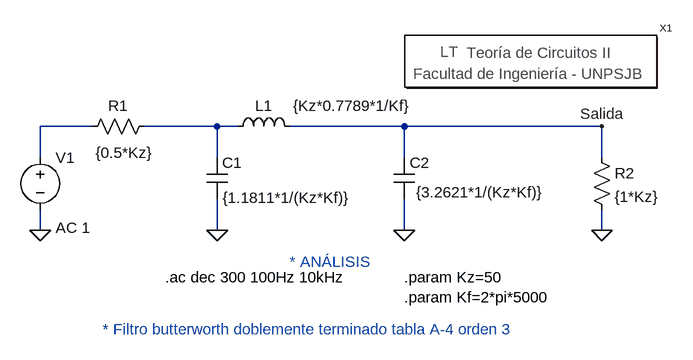
[diagram p0: schematic FiltroButterworthOrden3.asc]
FiltroButterworthOrden3.asc, the LTspice schematic file:
Version 4
SHEET 1 988 680
WIRE 96 160 16 160
WIRE 288 160 176 160
WIRE 320 160 288 160
WIRE 576 160 400 160
WIRE 880 160 576 160
WIRE 16 208 16 160
WIRE 288 208 288 160
WIRE 576 208 576 160
WIRE 880 208 880 160
WIRE 16 320 16 288
WIRE 288 320 288 272
WIRE 576 320 576 272
WIRE 880 320 880 288
FLAG 16 320 0
FLAG 880 320 0
FLAG 576 320 0
FLAG 288 320 0
FLAG 880 160 Salida
SYMBOL Circuitos2\\Letreros\\Teoría\ de\ Circuitos\ II 768 64 R0
SYMATTR InstName X1
SYMBOL voltage 16 192 R0
WINDOW 123 24 124 Left 2
WINDOW 39 0 0 Left 0
SYMATTR Value2 AC 1
SYMATTR InstName V1
SYMATTR Value ""
SYMBOL res 192 144 R90
WINDOW 0 0 56 VBottom 2
WINDOW 3 41 47 VTop 2
SYMATTR InstName R1
SYMATTR Value {0.5*Kz}
SYMBOL cap 272 208 R0
WINDOW 3 25 62 Left 2
SYMATTR InstName C1
SYMATTR Value {1.1811*1/(Kz*Kf)}
SYMBOL ind 304 176 R270
WINDOW 0 32 56 VTop 2
WINDOW 3 63 191 VBottom 2
SYMATTR InstName L1
SYMATTR Value {Kz*0.7789*1/Kf}
SYMBOL cap 560 208 R0
WINDOW 3 34 53 Left 2
SYMATTR InstName C2
SYMATTR Value {3.2621*1/(Kz*Kf)}
SYMBOL res 864 192 R0
SYMATTR InstName R2
SYMATTR Value {1*Kz}
TEXT 112 472 Left 2 ;* Filtro butterworth doblemente terminado tabla A-4 orden 3
TEXT 208 392 Left 2 !.ac dec 300 100Hz 10kHz
TEXT 400 368 Left 2 ;* ANÁLISIS
TEXT 576 392 Left 2 !.param Kz=50\n.param Kf=2*pi*5000

The netlist it stands for:
* FiltroButterworthOrden3.asc
XX1 Teoría de Circuitos II
V1 N001 0 AC 1
R1 N002 N001 {0.5*Kz}
C1 N002 0 {1.1811*1/(Kz*Kf)}
L1 N002 Salida {Kz*0.7789*1/Kf}
C2 Salida 0 {3.2621*1/(Kz*Kf)}
R2 Salida 0 {1*Kz}
* * Filtro butterworth doblemente terminado tabla A-4 orden 3
.ac dec 300 100Hz 10kHz
* * ANÁLISIS
.param Kz=50
.param Kf=2*pi*5000
.backanno
.end